# EAGLE design main_schematic_correction (EAGLE 7.1.0)
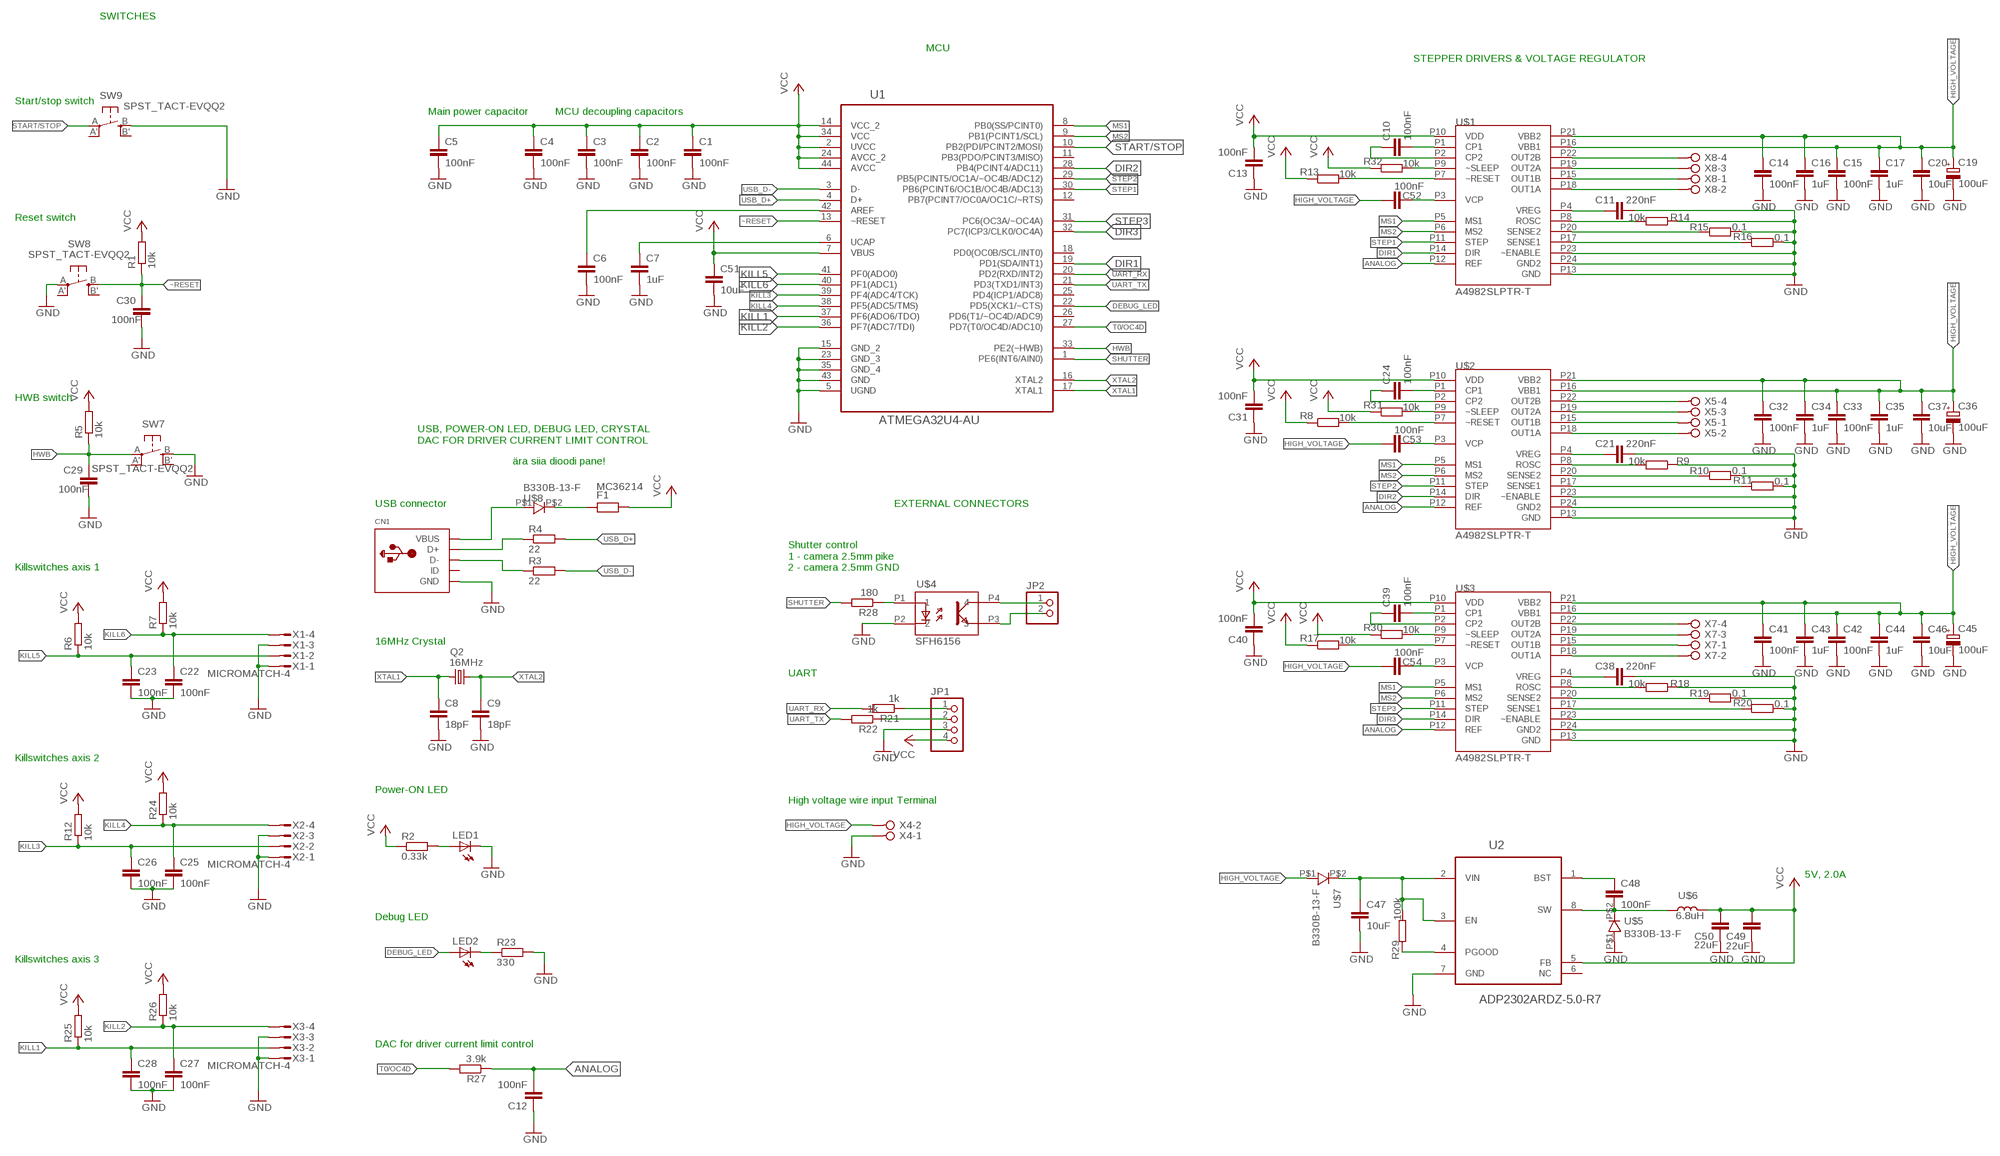
[diagram p0: schematic, sheet 1]

## Parts
C1  100nF  C-EUC0603K  [C0603K]
C2  100nF  C-EUC0603K  [C0603K]
C3  100nF  C-EUC0603K  [C0603K]
C4  100nF  C-EUC0603K  [C0603K]
C5  100nF  C-EUC0603K  [C0603K]
C6  100nF  C-EUC0603K  [C0603K]
C7  1uF  C-EUC0603K  [C0603K]
C8  18pF  C-EUC0603K  [C0603K]
C9  18pF  C-EUC0603K  [C0603K]
C10  100nF  C-EUC0603K  [C0603K]
C11  220nF  C-EUC0603K  [C0603K]
C12  100nF  C-EUC0603K  [C0603K]
C13  100nF  C-EUC0603K  [C0603K]
C14  100nF  C-EUC0603K  [C0603K]
C15  100nF  C-EUC0603K  [C0603K]
C16  1uF  C-EUC0603K  [C0603K]
C17  1uF  C-EUC0603K  [C0603K]
C19  100uF  CPOL-EUE/7260-38R  [E/7260-38R]
C20  10uF  C-EUC1206K  [C1206K]
C21  220nF  C-EUC0603K  [C0603K]
C22  100nF  C-EUC0603K  [C0603K]
C23  100nF  C-EUC0603K  [C0603K]
C24  100nF  C-EUC0603K  [C0603K]
C25  100nF  C-EUC0603K  [C0603K]
C26  100nF  C-EUC0603K  [C0603K]
C27  100nF  C-EUC0603K  [C0603K]
C28  100nF  C-EUC0603K  [C0603K]
C29  100nF  C-EUC0603K  [C0603K]
C30  100nF  C-EUC0603K  [C0603K]
C31  100nF  C-EUC0603K  [C0603K]
C32  100nF  C-EUC0603K  [C0603K]
C33  100nF  C-EUC0603K  [C0603K]
C34  1uF  C-EUC0603K  [C0603K]
C35  1uF  C-EUC0603K  [C0603K]
C36  100uF  CPOL-EUE/7260-38R  [E/7260-38R]
C37  10uF  C-EUC1206K  [C1206K]
C38  220nF  C-EUC0603K  [C0603K]
C39  100nF  C-EUC0603K  [C0603K]
C40  100nF  C-EUC0603K  [C0603K]
C41  100nF  C-EUC0603K  [C0603K]
C42  100nF  C-EUC0603K  [C0603K]
C43  1uF  C-EUC0603K  [C0603K]
C44  1uF  C-EUC0603K  [C0603K]
C45  100uF  CPOL-EUE/7260-38R  [E/7260-38R]
C46  10uF  C-EUC1206K  [C1206K]
C47  10uF  C-EUC1206K  [C1206K]
C48  100nF  C-EUC1206K  [C1206K]
C49  22uF  C-EUC1206K  [C1206K]
C50  22uF  C-EUC1206K  [C1206K]
C51  10uF  C-EUC0805  [C0805]
C52  100nF  C-EUC0603K  [C0603K]
C53  100nF  C-EUC0603K  [C0603K]
C54  100nF  C-EUC0603K  [C0603K]
CN1  USBMINIB  [USB-MINIB]
F1  MC36214  [MC36214]
JP1  PINHD-1X4  [1X04]
JP2  PINHD-1X2  [1X02]
LED1  LEDCHIP-LED0603  [CHIP-LED0603]
LED2  LEDCHIP-LED0603  [CHIP-LED0603]
Q2  16MHz  CRYSTALSM49  [SM49]
R1  10k  R-EU_R0603  [R0603]
R2  0.33k  R-EU_R0603  [R0603]
R3  22  R-EU_R0603  [R0603]
R4  22  R-EU_R0603  [R0603]
R5  10k  R-EU_R0603  [R0603]
R6  10k  R-EU_R0603  [R0603]
R7  10k  R-EU_R0603  [R0603]
R8  10k  R-EU_R0603  [R0603]
R9  10k  R-EU_R0603  [R0603]
R10  0.1  R-EU_R0805  [R0805]
R11  0.1  R-EU_R0805  [R0805]
R12  10k  R-EU_R0603  [R0603]
R13  10k  R-EU_R0603  [R0603]
R14  10k  R-EU_R0603  [R0603]
R15  0.1  R-EU_R0805  [R0805]
R16  0.1  R-EU_R0805  [R0805]
R17  10k  R-EU_R0603  [R0603]
R18  10k  R-EU_R0603  [R0603]
R19  0.1  R-EU_R0805  [R0805]
R20  0.1  R-EU_R0805  [R0805]
R21  1k  R-EU_R0603  [R0603]
R22  1k  R-EU_R0603  [R0603]
R23  330  R-EU_R0603  [R0603]
R24  10k  R-EU_R0603  [R0603]
R25  10k  R-EU_R0603  [R0603]
R26  10k  R-EU_R0603  [R0603]
R27  3.9k  R-EU_R0603  [R0603]
R28  180  R-EU_R0603  [R0603]
R29  100k  R-EU_R0603  [R0603]
R30  10k  R-EU_R0603  [R0603]
R31  10k  R-EU_R0603  [R0603]
R32  10k  R-EU_R0603  [R0603]
SW7  SPST_TACT-EVQQ2  [EVQ-Q2]
SW8  SPST_TACT-EVQQ2  [EVQ-Q2]
SW9  SPST_TACT-EVQQ2  [EVQ-Q2]
U1  ATMEGA32U4-AU  [QFP80P1200X1200X120-44N]
U2  ADP2302ARDZ-5.0-R7  [SOIC127P600X175-9N]
U$1  A4982SLPTR-T  [TSSOP_24]
U$2  A4982SLPTR-T  [TSSOP_24]
U$3  A4982SLPTR-T  [TSSOP_24]
U$4  SFH6156  [SFH6165]
U$5  B330B-13-F  SCHOTTK_YB330B-13-F  [B330B-13-F]
U$6  6.8uH  VLF10040  [VLF10040]
U$7  B330B-13-F  SCHOTTK_YB330B-13-F  [B330B-13-F]
U$8  B330B-13-F  SCHOTTK_YB330B-13-F  [B330B-13-F]
X1  MICROMATCH-4  [MICROMATCH-4]
X2  MICROMATCH-4  [MICROMATCH-4]
X3  MICROMATCH-4  [MICROMATCH-4]
X4  W237-02P  [W237-132]
X5  W237-04P  [W237-4P]
X7  W237-04P  [W237-4P]
X8  W237-04P  [W237-4P]

## Nets
ANALOG: C12.2 R27.1 U$1.P12(REF) U$2.P12(REF) U$3.P12(REF)
DEBUG_LED: LED2.A U1.22(PD5(XCK1/~CTS))
DIR1: U1.19(PD1(SDA/INT1)) U$1.P14(DIR)
DIR2: U1.28(PB4(PCINT4/ADC11)) U$2.P14(DIR)
DIR3: U1.32(PC7(ICP3/CLK0/OC4A)) U$3.P14(DIR)
GND: C1.2 C2.2 C3.2 C4.2 C5.2 C6.2 C7.2 C8.2 C9.2 C11.1 C12.1 C13.1 C14.2 C15.2 C16.2 C17.2 C19.- C20.2 C21.1 C22.2 C23.2 C25.2 C26.2 C27.2 C28.2 C29.2 C30.2 C31.1 C32.2 C33.2 C34.2 C35.2 C36.- C37.2 C38.1 C40.1 C41.2 C42.2 C43.2 C44.2 C45.- C46.2 C47.2 C49.1 C50.1 C51.2 CN1.GND JP1.3 LED1.C R9.1 R10.2 R11.2 R14.1 R15.2 R16.2 R18.1 R19.2 R20.2 R23.2 SW7.B(S) SW8.A(P) SW9.B(S) U1.5(UGND) U1.15(GND_2) U1.23(GND_3) U1.35(GND_4) U1.43(GND) U2.7(GND) U$1.P13(GND) U$1.P23(~ENABLE) U$1.P24(GND2) U$2.P13(GND) U$2.P23(~ENABLE) U$2.P24(GND2) U$3.P13(GND) U$3.P23(~ENABLE) U$3.P24(GND2) U$4.P2 U$5.P$1 X1.1 X1.3 X2.1 X2.3 X3.1 X3.3 X4.1
HIGH_VOLTAEG: C47.1 R29.2 U2.2(VIN) U2.3(EN) U$7.P$2
HIGH_VOLTAGE: C14.1 C15.1 C16.1 C17.1 C19.+ C20.1 C32.1 C33.1 C34.1 C35.1 C36.+ C37.1 C41.1 C42.1 C43.1 C44.1 C45.+ C46.1 U$1.P16(VBB1) U$1.P21(VBB2) U$2.P16(VBB1) U$2.P21(VBB2) U$3.P16(VBB1) U$3.P21(VBB2) U$7.P$1 X4.2
HWB: C29.1 R5.1 SW7.A(P) U1.33(PE2(~HWB))
KILL1: C28.1 R25.1 U1.37(PF6(ADO6/TDO)) X3.2
KILL2: C27.1 R26.1 U1.36(PF7(ADC7/TDI)) X3.4
KILL3: C26.1 R12.1 U1.39(PF4(ADC4/TCK)) X2.2
KILL4: C25.1 R24.1 U1.38(PF5(ADC5/TMS)) X2.4
KILL5: C23.1 R6.1 U1.41(PF0(ADO0)) X1.2
KILL6: C22.1 R7.1 U1.40(PF1(ADC1)) X1.4
MS1: U1.8(PB0(SS/PCINT0)) U$1.P5(MS1) U$2.P5(MS1) U$3.P5(MS1)
MS2: U1.9(PB1(PCINT1/SCL)) U$1.P6(MS2) U$2.P6(MS2) U$3.P6(MS2)
N$1: JP2.1 U$4.P4
N$2: C6.1 U1.42(AREF)
N$3: LED1.A R2.2
N$4: CN1.D- R3.1
N$5: CN1.D+ R4.1
N$6: C10.2 U$1.P1(CP1)
N$7: C10.1 U$1.P2(CP2)
N$8: U$1.P15(OUT1B) X8.1
N$9: U$1.P22(OUT2B) X8.4
N$10: C11.2 U$1.P4(VREG)
N$11: C7.1 U1.6(UCAP)
N$12: R13.2 U$1.P7(~RESET)
N$13: C24.2 U$2.P1(CP1)
N$14: R14.2 U$1.P8(ROSC)
N$15: R15.1 U$1.P20(SENSE2)
N$16: R16.1 U$1.P17(SENSE1)
N$17: C24.1 U$2.P2(CP2)
N$18: U$1.P19(OUT2A) X8.3
N$19: R10.1 U$2.P20(SENSE2)
N$20: U$1.P18(OUT1A) X8.2
N$21: R11.1 U$2.P17(SENSE1)
N$22: U$2.P22(OUT2B) X5.4
N$23: U$2.P15(OUT1B) X5.1
N$24: U$2.P19(OUT2A) X5.3
N$25: U$2.P18(OUT1A) X5.2
N$26: C21.2 U$2.P4(VREG)
N$27: R8.2 U$2.P7(~RESET)
N$28: R9.2 U$2.P8(ROSC)
N$29: C39.2 U$3.P1(CP1)
N$30: C39.1 U$3.P2(CP2)
N$31: R19.1 U$3.P20(SENSE2)
N$32: R20.1 U$3.P17(SENSE1)
N$33: U$3.P22(OUT2B) X7.4
N$34: U$3.P15(OUT1B) X7.1
N$35: U$3.P19(OUT2A) X7.3
N$36: U$3.P18(OUT1A) X7.2
N$37: C38.2 U$3.P4(VREG)
N$38: R17.2 U$3.P7(~RESET)
N$39: CN1.VBUS U$8.P$1
N$40: JP1.1 R21.1
N$41: JP1.2 R22.1
N$42: JP2.2 U$4.P3
N$43: R18.2 U$3.P8(ROSC)
N$44: LED2.C R23.1
N$45: R29.1 U2.4(PGOOD)
N$47: C48.1 U2.1(BST)
N$48: R28.1 U$4.P1
N$49: F1.P$1 U$8.P$2
N$50: C52.1 U$1.P3(VCP)
N$51: C48.2 U2.8(SW) U$5.P$2 U$6.P$2
N$52: C53.1 U$2.P3(VCP)
N$53: C54.1 U$3.P3(VCP)
N$78: R30.2 U$3.P9(~SLEEP)
N$95: R31.2 U$2.P9(~SLEEP)
N$98: R32.2 U$1.P9(~SLEEP)
N$134: C52.2
N$135: C53.2
N$136: C54.2
SHUTTER: R28.2 U1.1(PE6(INT6/AIN0))
START/STOP: SW9.A(P) U1.10(PB2(PDI/PCINT2/MOSI))
STEP1: U1.30(PB6(PCINT6/OC1B/OC4B/ADC13)) U$1.P11(STEP)
STEP2: U1.29(PB5(PCINT5/OC1A/~OC4B/ADC12)) U$2.P11(STEP)
STEP3: U1.31(PC6(OC3A/~OC4A)) U$3.P11(STEP)
T0/OC4D: R27.2 U1.27(PD7(T0/OC4D/ADC10))
UART_RX: R21.2 U1.20(PD2(RXD/INT2))
UART_TX: R22.2 U1.21(PD3(TXD1/INT3))
USB_D+: R4.2 U1.4(D+)
USB_D-: R3.2 U1.3(D-)
VCC: C1.1 C2.1 C3.1 C4.1 C5.1 C13.2 C31.2 C40.2 C49.2 C50.2 C51.1 F1.P$2 JP1.4 R1.2 R2.1 R5.2 R6.2 R7.2 R8.1 R12.2 R13.1 R17.1 R24.2 R25.2 R26.2 R30.1 R31.1 R32.1 U1.2(UVCC) U1.7(VBUS) U1.14(VCC_2) U1.24(AVCC_2) U1.34(VCC) U1.44(AVCC) U2.5(FB) U$1.P10(VDD) U$2.P10(VDD) U$3.P10(VDD) U$6.P$1
XTAL1: C8.1 Q2.1 U1.17(XTAL1)
XTAL2: C9.1 Q2.2 U1.16(XTAL2)
~RESET: C30.1 R1.1 SW8.B(S) U1.13(~RESET)
Unconnected: CN1.ID SW7.A'(P1) SW7.B'(S1) SW8.A'(P1) SW8.B'(S1) SW9.A'(P1) SW9.B'(S1) U1.11(PB3(PDO/PCINT3/MISO)) U1.12(PB7(PCINT7/OC0A/OC1C/~RTS)) U1.18(PD0(OC0B/SCL/INT0)) U1.25(PD4(ICP1/ADC8)) U1.26(PD6(T1/~OC4D/ADC9)) U2.6(NC)

## Notes on the sheet
- SWITCHES
- MCU
- STEPPER DRIVERS & VOLTAGE REGULATOR
- Start/stop switch
- Main power capacitor | MCU decoupling capacitors
- Reset switch
- HWB switch
- USB, POWER-ON LED, DEBUG LED, CRYSTAL
  DAC FOR DRIVER CURRENT LIMIT CONTROL
- ära siia dioodi pane!
- USB connector | EXTERNAL CONNECTORS
- Killswitches axis 1
- Shutter control
  1 - camera 2.5mm pike
  2 - camera 2.5mm GND
- 16MHz Crystal
- UART
- Killswitches axis 2
- Power-ON LED
- High voltage wire input Terminal
- 5V, 2.0A
- Debug LED
- Killswitches axis 3
- DAC for driver current limit control

## Library data of the parts
C1-C17 C20-C35 C37-C44 C46-C54 = rcl:C-EU: CAPACITOR, European symbol
C19 C36 C45 = rcl:CPOL-EU: POLARIZED CAPACITOR, European symbol
CN1 = adafruit:USB: USB Connectors USBMINIB - Surface Mount Female Mini-B USB Connector 4UConnector: 06564 By microbuilder.eu Thru-hole RA Female Mini-B USB Connector 4UConnector: 18732 By ladyada.net
F1 = PTC:MC36214
JP1 = pinhead:PINHD-1X4: PIN HEADER
JP2 = pinhead:PINHD-1X2: PIN HEADER
LED1 LED2 = adafruit:LED: LED OSRAM: - CHIPLED LG R971, LG N971, LY N971, LG Q971, LY Q971, LO R971, LY R971 LH N974, LH R974 LS Q976, LO Q976, LY Q976 LO Q996 - Hyper CHIPLED LW Q18S LB Q993, LB Q99A, LB R99A - SideLED LS A670, LO A670, LY A670, LG A670, LP A670 LB A673, LV A673, LT A673, LW A673 LH A674 LY A675 LS A676, LA A676, LO A676, LY A676, LW A676 LS A679, LY A679, LG A679 - Hyper Micro SIDELED® LS Y876, LA Y876, LO Y876, LY Y876 LT Y87S - SmartLED LW L88C, LW L88S LB L89C, LB L89S, LG L890 LS L89K, LO L89K, LY L89K LS L896, LA L896, LO L896, LY L896 - TOPLED LS T670, LO T670, LY T670, LG T670, LP T670 LSG T670, LSP T670, LSY T670, LOP T670, LYG T670 LG T671, LOG T671, LSG T671 LB T673, LV T673, LT T673, LW T673 LH T674 LS T676, LA T676, LO T676, LY T676, LB T676, LH T676, LSB T676, LW T676 LB T67C, LV T67C, LT T67C, LS T67K, LO T67K, LY T67K, LW E67C LS E67B, LA E67B, LO E67B, LY E67B, LB E67C, LV E67C, LT E67C LW T67C LS T679, LY T679, LG T679 LS T770, LO T770, LY T770, LG T770, LP T770 LB T773, LV T773, LT T773, LW T773 LH T774 LS E675, LA E675, LY E675, LS T675 LS T776, LA T776, LO T776, LY T776, LB T776 LHGB T686 LT T68C, LB T68C - Hyper Mini TOPLED® LB M676 - Mini TOPLED Santana® LG M470 LS M47K, LO M47K, LY M47K Source: http://www.osram.convergy.de/
Q2 = crystal:CRYSTAL: CRYSTAL; OC_FARNELL: unknown; OC_NEWARK: unknown
R1-R32 = rcl:R-EU_: RESISTOR, European symbol
SW7-SW9 = adafruit:SPST_TACT: SMT 6mm switch, EVQQ2 series http://www.ladyada.net/library/eagle
U1 = ATmega32U4:ATMEGA32U4-AU: 8-bit Microcontroller with ISP Flash and USB Controller; MPN: ATMEGA32U4-AU; OC_FARNELL: 1748525; OC_NEWARK: 26R5633; PACKAGE: TQFP-44; SUPPLIER: Atmel
U2 = ADP2302ARDZ-5.0-R7:ADP2302ARDZ-5.0-R7: Step-Down Regulators; MPN: ADP2302ARDZ-5.0-R7; OC_FARNELL: 2312892; OC_NEWARK: 67W2704; PACKAGE: SOIC-8; SUPPLIER: Analog Devices
U$1-U$3 = Allegro_A4982_driver:A4982SLPTR-T
U$4 = SFH6156:SFH6156
U$5 U$7 U$8 = schottky_B330B-13-F:SCHOTTK_YB330B-13-F
U$6 = InductorVLF10040:VLF10040
X1-X3 = con-amp-micromatch:MICROMATCH-4: MicroMaTch 4 7-215464-4 / 0-215464-4 Drawing Number C-215464 DDEController.pdf; MPN: 7-215464-4; OC_FARNELL: 3784629; OC_NEWARK: 19R8124
X4 = con-wago-508:W237-02P: WAGO SREW CLAMP; OC_FARNELL: unknown; OC_NEWARK: unknown
X5 X7 X8 = con-wago-508:W237-04P: WAGO SREW CLAMP; OC_FARNELL: unknown; OC_NEWARK: unknown

## Board
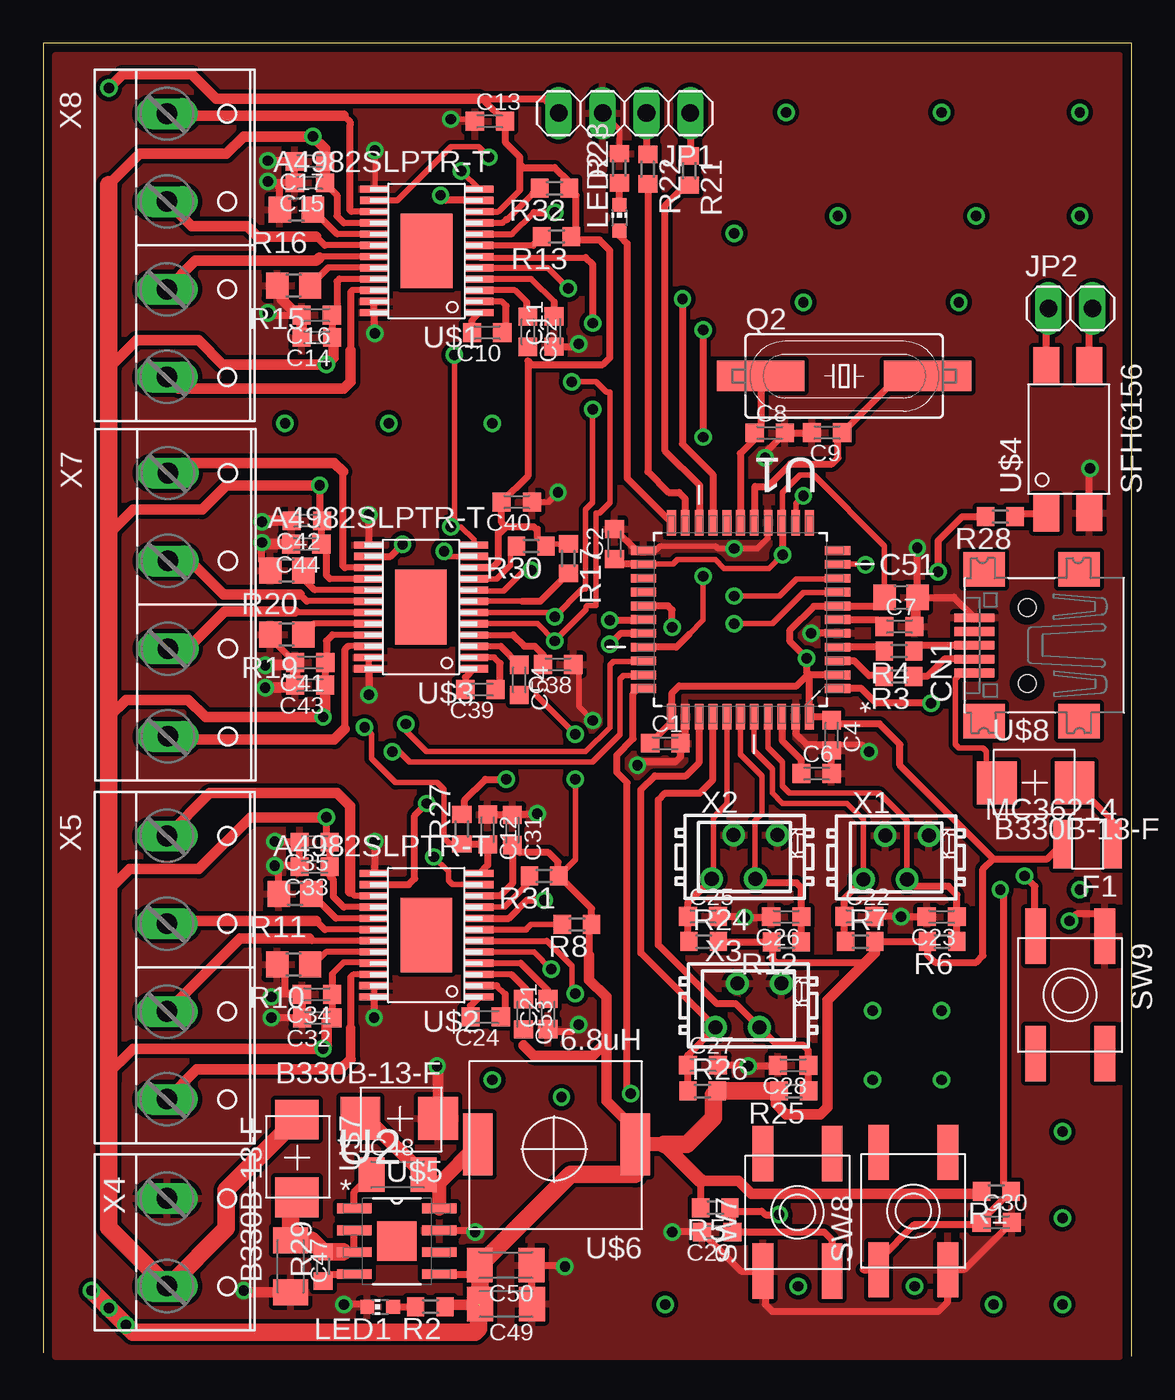
[diagram p1: board, top side]
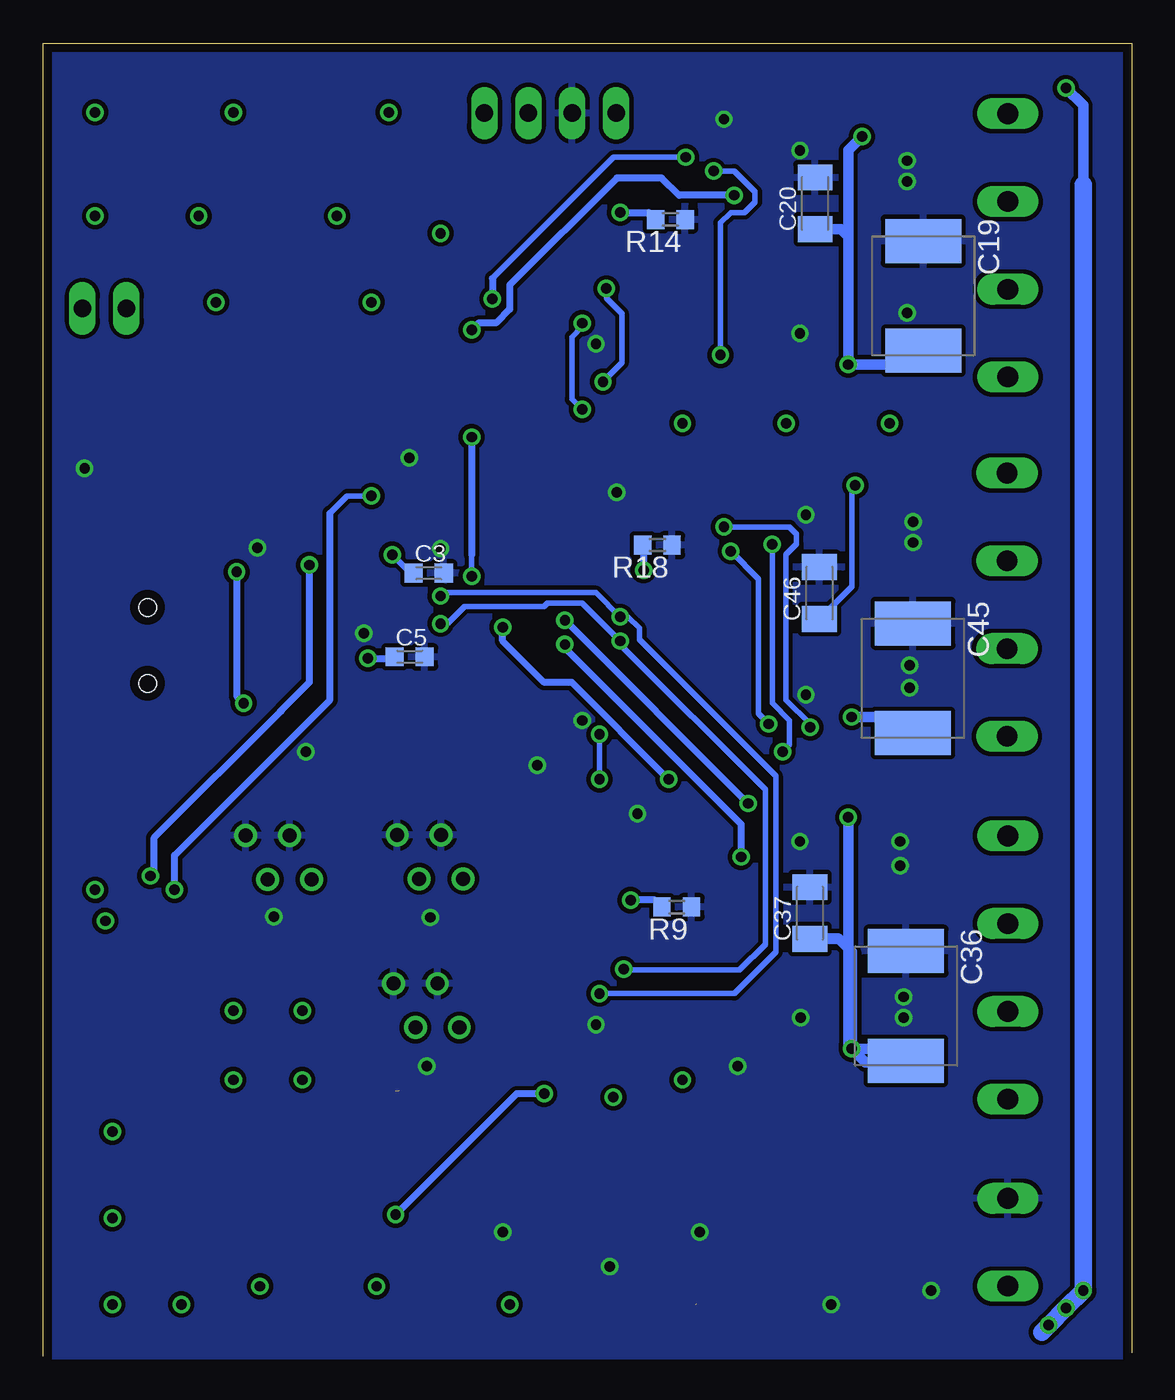
[diagram p2: board, bottom side, seen from below]

Size 63 x 76 mm. Coordinates in mm from the lower left corner, seen from the top.
Outline: 63,0 63,76 0,76 0,0.2
Copper layers (1*16): Top 0.035mm / dielectric 1.5mm / Bottom 0.035mm
Design rules "EDT_DRC": minimum track width 0.3mm, minimum drill 0.5mm, track to track 0.25mm, track to pad 0.25mm, pad to pad 0.25mm, via to via 0.25mm, smd to smd 0mil, copper to edge 0.5mm, drill to drill 8mil, minimum pad ring 10mil, minimum via ring 8mil, stop-mask expansion 4mil, vias tented up to drill 0mil, thermal gap 10mil

### Footprints (pad centres in the part's own frame; a part is rotated, then mirrored left to right if it is on the bottom)
C0603K = smd 1.05 x 1.08: 1 -0.875,0; 2 0.875,0
E/7260-38R = smd 2.55 x 4.4: + 3.175,0; - -3.175,0
C1206K = smd 1.5 x 2: 1 -1.5,0; 2 1.5,0
C0805 = smd 1.3 x 1.5: 1 -0.95,0; 2 0.95,0
USB-MINIB = smd 0.5 x 2.308: D+ 0,4.064; D- -0.8,4.064; GND 1.6,4.064; ID 0.8,4.064; VBUS -1.6,4.064 | smd 2 x 2.4: GND1 -4.4,-2; GND2 -4.4,3.5; GND3 4.4,3.5; GND4 4.4,-2 | hole 1: -2.2,1; 2.2,1
MC36214 = smd 1 x 2.8: P$1 0.239,1.4; P$2 3.196,1.39
1X04 = drill 1.016 long: 1 -3.81,0; 2 -1.27,0; 3 1.27,0; 4 3.81,0
1X02 = drill 1.016 long: 1 -1.27,0; 2 1.27,0
CHIP-LED0603 = smd 0.8 x 0.8: A 0,-0.75; C 0,0.75
SM49 = smd 5.08 x 1.778: 1 -4.826,0; 2 4.826,0
R0603 = smd 1 x 1.1: 1 -0.85,0; 2 0.85,0
R0805 = smd 1.3 x 1.5: 1 -0.95,0; 2 0.95,0
EVQ-Q2 = smd 3.2 x 1.2: A -3.4,-2; A' 3.4,-2; B -3.4,2; B' 3.4,2
QFP80P1200X1200X120-44N = smd 1.473 x 0.508: 1 -5.613,3.988; 2 -5.613,3.2; 3 -5.613,2.388; 4 -5.613,1.6; 5 -5.613,0.787; 6 -5.613,0; 7 -5.613,-0.787; 8 -5.613,-1.6; 9 -5.613,-2.388; 10 -5.613,-3.2; 11 -5.613,-3.988; 23 5.613,-3.988; 24 5.613,-3.2; 25 5.613,-2.388; 26 5.613,-1.6; 27 5.613,-0.787; 28 5.613,0; 29 5.613,0.787; 30 5.613,1.6; 31 5.613,2.388; 32 5.613,3.2; 33 5.613,3.988 | smd 0.508 x 1.473: 12 -3.988,-5.613; 13 -3.2,-5.613; 14 -2.388,-5.613; 15 -1.6,-5.613; 16 -0.787,-5.613; 17 0,-5.613; 18 0.787,-5.613; 19 1.6,-5.613; 20 2.388,-5.613; 21 3.2,-5.613; 22 3.988,-5.613; 34 3.988,5.613; 35 3.2,5.613; 36 2.388,5.613; 37 1.6,5.613; 38 0.787,5.613; 39 0,5.613; 40 -0.787,5.613; 41 -1.6,5.613; 42 -2.388,5.613; 43 -3.2,5.613; 44 -3.988,5.613
SOIC127P600X175-9N = smd 1.981 x 0.559: 1 -2.464,1.905; 2 -2.464,0.635; 3 -2.464,-0.635; 4 -2.464,-1.905; 5 2.464,-1.905; 6 2.464,-0.635; 7 2.464,0.635; 8 2.464,1.905 | smd 2.286 x 2.286: 9 0,0
TSSOP_24 = smd 1.65 x 0.42: P1 -3.175,3.67; P2 -3.175,3.02; P3 -3.175,2.37; P4 -3.175,1.72; P5 -3.175,1.07; P6 -3.175,0.42; P7 -3.175,-0.23; P8 -3.175,-0.88; P9 -3.175,-1.53; P10 -3.175,-2.18; P11 -3.175,-2.83; P12 -3.175,-3.48; P13 2.925,-3.48; P14 2.925,-2.83; P15 2.925,-2.18; P16 2.925,-1.53; P17 2.925,-0.88; P18 2.925,-0.23; P19 2.925,0.42; P20 2.925,1.07; P21 2.925,1.72; P22 2.925,2.37; P23 2.925,3.02; P24 2.925,3.67 | smd 3 x 4.32: P$1 -0.102,0.099
SFH6165 = smd 2.1 x 1.5: P1 -1.13,3.656; P2 -1.12,1.156; P3 7.446,1.156; P4 7.442,3.656
B330B-13-F = smd 2.3 x 2.5: P$1 -2.2,-0.022; P$2 2.299,-0.022
VLF10040 = smd 1.7 x 3.6: P$1 0.4,4.8; P$2 9.51,4.8
MICROMATCH-4 = drill 0.813: 1 1.905,1.27; 2 0.635,-1.27; 3 -0.635,1.27; 4 -1.905,-1.27
W237-132 = drill 1.194 long: 1 -2.54,-0.635; 2 2.54,-0.635
W237-4P = drill 1.194 long: 1 -7.62,-0.635; 2 -2.54,-0.635; 3 2.54,-0.635; 4 7.62,-0.635

### Placement (x,y rotation side)
C1  36.01,35.48 0 top
C2  33.07,47.01 90 top
C3  40.69,45.33 0 bottom
C4  45.63,35.94 270 top
C5  41.79,40.48 0 bottom
C6  44.76,33.73 0 top
C7  49.56,42.24 0 top
C8  42.06,53.44 0 top
C9  45.37,53.46 180 top
C10  25.7,59.25 180 top
C11  29.57,59.31 90 top
C12  25.73,30.49 270 top
C13  25.86,71.48 0 top
C14  15.84,58.97 180 top
C15  15.44,67.92 180 top
C16  15.83,60.26 180 top
C17  15.44,69.16 180 top
C19  12.06,61.37 270 bottom
C20  18.32,66.73 90 bottom
C21  29.22,19.81 90 top
C22  47.24,25.46 0 top
C23  52.01,25.44 180 top
C24  25.61,19.64 180 top
C25  38.19,25.46 0 top
C26  43.01,25.44 180 top
C27  38.19,16.86 0 top
C28  43.41,16.84 180 top
C29  39.01,7.19 180 top
C30  55.19,7.76 0 top
C31  27.16,30.46 270 top
C32  15.86,19.59 180 top
C33  15.71,28.34 180 top
C34  15.85,20.95 180 top
C35  15.71,29.76 180 top
C36  13.06,20.28 270 bottom
C37  18.62,25.65 90 bottom
C38  29.81,40.04 180 top
C39  25.31,38.59 180 top
C40  27.41,49.44 180 top
C41  15.46,40.16 180 top
C42  15.26,48.36 180 top
C43  15.45,38.85 180 top
C44  15.23,47.01 180 top
C45  12.66,39.24 270 bottom
C46  18.07,44.17 90 bottom
C47  14.32,5.21 270 top
C48  20.51,10.52 0 top
C49  26.79,3.03 180 top
C50  26.77,5.28 180 top
C51  49.65,43.93 0 top
C52  28.05,59.3 270 top
C53  27.8,19.8 270 top
C54  27.55,39.15 270 top
CN1  57.96,41.15 90 top
F1  62.17,31.03 180 top
JP1  33.65,71.95 180 top
JP2  59.46,60.65 0 top
LED1  19.51,2.86 90 top
LED2  33.35,65.89 0 top
Q2  46.36,56.74 0 top
R1  55.17,9.55 180 top
R2  22.41,2.88 180 top
R3  49.53,39.35 180 top
R4  49.54,40.82 180 top
R5  38.9,8.6 180 top
R6  52.03,24 180 top
R7  47.29,24 0 top
R8  30.89,25 180 top
R9  26.33,26 180 bottom
R10  14.5,22.68 180 top
R11  14.58,26.77 180 top
R12  43.02,23.98 180 top
R13  29.71,64.8 180 top
R14  26.69,65.8 180 bottom
R15  14.5,61.97 180 top
R16  14.65,66.37 180 top
R17  30.4,46.17 270 top
R18  27.45,46.95 180 bottom
R19  14.1,41.77 180 top
R20  14.1,45.47 180 top
R21  37.4,68.63 270 top
R22  35,68.71 270 top
R23  33.35,68.76 90 top
R24  38.23,24 0 top
R25  43.45,15.35 180 top
R26  38.17,15.35 0 top
R27  24.23,30.51 90 top
R28  55.4,48.6 180 top
R29  16.2,5.2 90 top
R30  28.25,46.9 180 top
R31  29,27.8 180 top
R32  29.6,67.6 180 top
SW7  43.66,8.33 90 top
SW8  50.36,8.41 90 top
SW9  59.44,20.91 270 top
U1  40.36,42.64 180 top
U2  20.47,6.66 0 top
U$1  22.08,64.07 180 top
U$2  22.07,24.47 180 top
U$3  21.76,43.47 180 top
U$4  61.71,49.92 90 top
U$5  20.66,13.75 180 top
U$6  34.66,17.07 180 top
U$7  14.7,11.5 270 top
U$8  57.4,33.2 0 top
X1  49.37,28.87 0 top
X2  40.6,28.9 0 top
X3  40.82,20.3 0 top
X4  7.8,6.6 270 top
X5  7.8,22.5 270 top
X7  7.85,43.5 270 top
X8  7.8,64.3 270 top

### Tracks (layer width: path | path; a pad name or v marks a point on that pad's centre or on a via)
ANALOG  (via drill 0.6)
  Top 0.305: R27.1 23.54,29.66 23.2,30 23.2,32.8 22.8,33.2 20.4,33.2 19,34.6 19,36 v18.6,36.4 | U$3.P12 24.93,47.27 24.2,48 v23.6,48 23.8,48.2 v23.8,57.95 | U$1.P12 v24.2,68.6
  Top 0.406: 25.28,27.98 U$2.P12 25.73,28.43 C12.2 25.68,29.66 R27.1
  Bottom 0.305: v18.6,36.4 18.6,36.6 20,38 20,46.4 19.4,47 19.4,47.6 19.8,48 v23.6,48 | v24.2,68.6 23,68.6 21.8,67.4 21.8,66.8 22.4,66.2 23.2,66.2 23.8,65.6 v23.8,57.95
DEBUG_LED
  Top 0.406: LED2.A 33.35,64.85 33.8,64.4 33.8,50.83 U1.22
DIR1  (via drill 0.6)
  Top 0.305: 20.5,66.9 23.6,70 25.2,70 v25.8,69.4
  Top 0.35: U$1.P14 20.5,66.9
  Top 0.406: v37,61.2 37,52.8 38.76,51.04 U1.19
  Bottom 0.305: v25.8,69.4 30,69.4 37,62.4
  Bottom 0.406: 37,62.4 v37,61.2
DIR2  (via drill 0.6)
  Top 0.406: U$2.P14 21.15,27.3 21.5,27.65 21.5,31.3 v22.2,32 22.25,32.05 | v32.8,42.6 34.71,42.6 U1.28
  Bottom 0.406: v22.2,32 v32.8,42.6
DIR3  (via drill 0.6)
  Top 0.305: U1.32 34.71,39.4 33.6,39.4 33.4,39.2 33.4,36 31.8,34.4 21.2,34.4 20.6,35 v20.2,35
  Top 0.406: U$3.P14 20.1,46.3 v20.8,47
  Bottom 0.305: v20.8,47 20.8,37.8 19.8,36.8 19.8,35.4 v20.2,35
GND  (via drill 0.6)
  Top 0.305: R23.2 33.35,70.98 JP1.3 | U1.43 43.6,36.99 43.6,36 | 44.2,35.4 47.4,35.4 v47.8,35 | U$1.P13 19.2,67.59 v19.2,69.8 | C13.1 24.86,71.6 v23.6,71.6 | 18.7,3 18.7,2.92 LED1.C | 31,40.35 31,37.6 v31.8,36.8 | C40.1 29.24,49.44 v29.8,50 | U1.15 41.96,47.36 41.35,46.75 v40,46.75 39.05,46.75 38.9,46.9 35.7,46.9 35.43,46.63 U1.23 35.17,46.63 35.2,46.6
  Top 0.35: U$3.P23 U$3.P24 | U$2.P23 U$2.P24 | 14,22.03 13.55,22.48 R10.2
  Top 0.406: 13.15,41.65 R19.2 13.15,41.6 | U$3.P13 18.85,46.97 v18.85,48.7 | U$3.P24 18.85,39.78 v18.85,38.3 | v12.65,47.1 12.65,46.01 13.15,45.51 R20.2 | U1.23 34.33,46.63 C2.2 | U1.35 37.16,35.76 C1.2 36.88,34.69 36.6,34.4 34.6,34.4 v34.4,34.2 | U1.5 v44.45,41.85 | SW9.B 61.44,25.56 61.4,25.6 59.8,25.6 59.4,25.2 | 18.7,3 v17.4,3 | C23.2 49.71,25.44 49.7,25.45 v49.65,25.45 C22.2 | C25.2 40.54,25.46 v40.6,25.4 42.09,25.4 C26.2 | U1.43 43.56,36.04 43.6,36 44.2,35.4 45.3,35.4 C4.2 C6.2 | C21.1 29.36,18.8 30.6,18.8 v31,19.2 | C31.1 27.23,31.4 v28.6,31.4 | U$2.P13 19.2,28 v19.2,29.8 | U$2.P24 v19.15,19.6 | C32.2 C34.2 13.35,20.95 | C35.2 C33.2 C35.2 14.8,29.8 | v13.4,29.8 14.8,29.8 | 14.8,29.8 14.8,28.4 v13.4,28.4 13.63,28.17 R11.2 | 13.35,20.95 v13.2,20.8 | 13.35,20.95 13.4,21 14,21 | v13.2,19.6 15,19.6 15,21 14,21 | 14,21 14,22.03 | U$4.P2 60.55,51.35 v60.6,51.4 | U2.7 24.91,7.29 v25,7.2 | U$1.P23 U$1.P24 19.16,59.24 v19.2,59.2 | C15.2 C17.2 | C15.2 C17.2 14.6,69.2 v13,69.2 | C15.2 13.4,67.92 | 13.4,67.92 13.08,67.92 v13,68 | R16.2 13.7,67.62 13.4,67.92 | C27.2 40.74,16.86 v40.8,16.8 42.49,16.8 C28.2 | C11.1 30.84,58.44 v31,58.6 | C49.1 28.27,3.05 C50.1 30.12,5.28 v30.2,5.2 | CN1.GND 52.72,43.93 C51.2 50.44,43.77 C7.2 | C9.2 44.48,53.44 C8.2 41.8,52.3 v41.8,52 | C7.2 50.48,42.2 | C7.2 50.6,42.41 v50.6,46.8 | 52.01,5.01 SW8.A | C30.2 53.31,5.01 SW8.A | SW8.A 52.36,3.16 51.8,2.6 42.2,2.6 41.8,3 41.8,4.79 SW7.B 40.4,4.93 C29.2 v36.4,7.2 | C31.1 27.01,31.34 | C12.1 27.13,31.36 C31.1 | 13.15,41.59 C41.2 | C38.1 31,40.35 | v13,60.4 13.14,60.26 C16.2
  Top 0.61: C44.2 12.74,47.01 v12.65,47.1 | C42.2 12.71,48.36 v12.65,48.3 | v12.85,38.7 14.65,38.7 14.65,38.77 C43.2 14.59,38.86 C41.2 | 14.55,40 v12.85,40 | C14.2 C16.2 | C16.2 14.89,60.2 | R15.2 13.8,61.72 13.8,61.2 14.74,60.26 C16.2 | C47.2 11.69,3.71 v11.6,3.8 | U$5.P$1 22.86,16.74 v22.8,16.8 | R19.2 13.15,41.59
  pour Bottom: 0,0 63,0 63,76 0.6,75.9
  pour Top: 0.7,75.3 0.7,0 62.3,0 62.3,75.3
HIGH_VOLTAEG
  Top 0.406: 17.35,6.05 17.4,6 17.98,6 U2.3 U2.2 | 15.54,6.71 C47.1 | U$7.P$2 14.32,8.84
  Top 1: 17.35,6.05 R29.2 15.54,6.71 | 14.32,8.84 C47.1
HIGH_VOLTAGE  (via drill 0.6)
  Top 0.35: U$3.P21 16.75,41.75 | U$3.P16 16.6,45 | U$2.P16 17.4,26 | 16.73,22.12 17.4,22.8 19.09,22.8 U$2.P21 | 17.4,65.6 U$1.P16 | U$1.P21 17.15,62.35
  Top 0.406: C14.1 16.71,60.25 C16.1 17,60.55 17,62.2 17.15,62.35 | 16.75,41.75 16.4,41.4 16.4,40.27 16.32,40.2 16.32,40.17 | 16.6,45 16.4,45.2 16.4,46.72 C44.1 16.11,48.33 C42.1 16,48.49 v16,50.4 | 17.4,26 16.8,26.6 16.8,27.6 16.59,27.82 C33.1 C35.1 16.4,29.95 v16.4,31.2 | 16.73,22.12 C34.1 C32.1 16.6,19.45 | 17.4,65.6 17,66 17,67.2 16.32,67.89 C15.1 | 7.26,4.06 X4.2 | 16.32,40.17 C43.1 | C41.1 16.32,40.17
  Top 0.61: 3.8,67.8 5.6,69.6 10.6,69.6 11.6,70.6 15.4,70.6 15.6,70.4 v15.6,70.6 16.32,69.89 C17.1 C15.1 | C14.1 16.71,58.63 16.8,58.55 16.8,57.8 v16.4,57.4 10.4,57.4 9,58.8 5.4,58.8 3.8,57.2 | v16,50.4 10.6,50.4 9.2,49 5.2,49 3.8,47.6 | 3.8,37 4.8,38 8.4,38 9.4,37 v16.2,37 16.32,37.12 C43.1 16.34,38.86 | v16.4,31.2 12,31.2 9,28.2 5,28.2 3.8,27 | 3.8,16 3.6,16.2 5.2,17.8 v16.2,17.8 16.4,18 16.4,19.4 16.45,19.45 16.6,19.45
  Top 1: X4.2 3.8,7.42 3.8,16 3.8,27 3.8,37 3.8,47.6 3.8,57.2 3.8,67.8 | U$7.P$1 10.6,9.62 10.6,7.4 7.26,4.06
  Bottom 0.305: 16.2,50.2 16.2,44.54 C46.1
  Bottom 0.406: 16.2,50.2 v16,50.4
  Bottom 0.61: C19.+ 12.86,57.4 v16.4,57.4 16.4,64.8 | 16.4,64.8 16.4,69.8 v15.6,70.6 | C20.1 16.83,65.23 16.4,64.8 | v16.2,37 13.6,37 C45.+ | v16.2,17.8 13.76,17.8 C36.+ | 16.2,31.2 v16.4,31.2 16.4,18 v16.2,17.8 | v16.2,17.8 16.2,23.4 16.95,24.15 | 18.6,24 18.6,24.2 17,24.2 16.95,24.15 | 13,17 15.4,17 v16.2,17.8 | C37.1 16.95,24.15
HWB  (via drill 0.6)
  Top 0.406: SW7.A 45.66,6.74 45.2,7.2 39.9,7.2 C29.1 39.88,8.46 R5.1 39.95,8.4 41.6,8.4 41.8,8.2 v42.6,8.2 | v34,15.2 33.8,15.4 33.8,33.2 33.2,33.8 33.2,34.8 34.15,35.75 34.15,38.35 34.45,38.65 U1.33
  Bottom 0.406: v34,15.2 35.6,15.2 v42.6,8.2
KILL1
  Top 0.406: R25.1 44.3,16.82 C28.1 44.28,17.71 44,18 42.48,18 X3.2 40.09,20.4 39,20.4 35.6,23.8 35.6,32.2 36,32.6 38,32.6 38.76,33.36 U1.37
KILL2
  Top 0.406: R26.1 C27.1 37.31,17.43 X3.4 34.6,23.34 34.6,32.8 35.4,33.6 37.2,33.6 37.97,34.37 U1.36
KILL3
  Top 0.305: X2.2 41.2,27.66 41.2,31 41.6,31.4 41.6,33.6 40.36,34.84 U1.39
  Top 0.406: X2.2 41.47,27.4 43.6,27.4 43.88,27.11 C26.1 43.87,25.43 R12.1
KILL4
  Top 0.305: X2.4 38.8,27.73 38.8,31.2 39.57,31.97 U1.38
  Top 0.406: X2.4 37.31,26.25 C25.1 37.31,24.07 R24.1
KILL5
  Top 0.305: 42,37 41.97,37.03 U1.41 41.96,35.24 42.8,34.4 42.8,33 43.2,32.6 48.41,32.6 50.01,31 X1.2
  Top 0.406: X1.2 50.41,27.2 52.4,27.2 52.88,26.71 C23.1 R6.1
KILL6
  Top 0.305: X1.4 47.47,31.07 46.53,32 42.8,32 42.2,32.6 42.2,34 41.15,35.05 U1.40
  Top 0.406: X1.4 46.37,26.5 C22.1 46.37,24.07 R7.1
MS1  (via drill 0.6)
  Top 0.305: U$2.P5 28.4,23.4 v29.4,22.4 | v40,42.4 42.2,42.4 44,44.2 45.93,44.2 U1.8 | v30.6,56.4 32,56.4 32.6,55.8 32.8,55.8 32.8,49.4 32.2,48.8 32,48.8 32,43.45 31.5,43.45 31.43,43.38 31.43,43.23 v29.6,41.4 28.6,42.4 U$3.P5
  Top 0.35: U$1.P5 29.2,63 v30.4,61.8
  Bottom 0.305: v29.6,41.4 29.6,41.55 | v29.6,41.4 31.8,43.6 33.8,43.6 34,43.4 38.6,43.4 39.6,42.4 v40,42.4 | v29.4,22.4 29.35,22.35 22.7,22.35 21.2,23.85 21.2,32.8 29.6,41.2 v29.6,41.4 | v30.4,61.8 30.4,61.25 29.5,60.35 29.5,57.5 v30.6,56.4
MS2  (via drill 0.6)
  Top 0.305: 29.15,24.05 30.6,22.6 30.6,21.2 v30.8,21 | v40,44 42.6,44 43.6,45 45.95,45 U1.9 | v31.8,54.8 31.8,49.4 31.4,49 31.4,44.4 31.2,44.4 v29.6,42.8 29.35,43.05 U$3.P6
  Top 0.35: U$2.P6 29.15,24.05 | 25.3,63.6 31.4,63.6
  Top 0.406: U$1.P6 25.3,63.6 | 31.4,63.6 31.8,63.2 v31.8,59.8
  Bottom 0.305: v40,44 39.8,44.2 31,44.2 v29.6,42.8 29.15,42.8 28.5,42.15 28.5,41.5 22.4,35.4 22,35 20.6,33.6 20.6,23.4 23,21 v30.8,21 | v31.8,59.8 31.8,59.6 32.4,59 32.4,55.4 v31.8,54.8
N$1
  Top 0.406: U$4.P4 58.05,60.51 JP2.1
N$2
  Top 0.406: C6.1 43.88,34.52 42.8,35.6 42.8,36.97 U1.42
N$3
  Top 0.406: LED1.A 21.54,2.86 R2.2
N$4
  Top 0.406: CN1.D- 52.15,40.35 51.15,39.35 R3.1
N$5
  Top 0.406: CN1.D+ 50.72,41.15 R4.1
N$6
  Top 0.35: 24.82,59.97 U$1.P1
  Top 0.406: C10.2 24.82,59.97
N$7
  Top 0.35: 26.8,60.8 26.55,61.05 U$1.P2
  Top 0.406: C10.1 26.65,59.25 26.8,59.4 26.8,60.8
N$8
  Top 0.35: U$1.P15 17.85,66.25
  Top 0.406: 17.85,66.25 17.75,66.35 17.75,71.2 17.75,71.25 17.75,71.45 17.4,71.8
  Top 0.61: 17.4,71.8 7.29,71.8 X8.1
N$9
  Top 0.35: U$1.P22 17.9,61.7
  Top 0.406: 17.9,61.7 17.8,61.6 17.8,58.2
  Top 0.61: 17.8,58.2 17.8,56.4 17.4,56 7.84,56 X8.4
N$10
  Top 0.35: U$1.P4 28.25,62.35 29.57,61.03
  Top 0.406: 29.57,61.03 C11.2
N$11
  Top 0.406: U1.6 48.28,42.64 C7.1
N$12
  Top 0.35: U$1.P7 28.36,64.3
  Top 0.406: 28.36,64.3 R13.2
N$13
  Top 0.406: U$2.P1 24.73,20.29 C24.2
N$14  (via drill 0.6)
  Top 0.35: U$1.P8 27.15,64.95 28.4,66.2
  Top 0.406: 28.4,66.2 v29.6,66.2
  Bottom 0.406: v29.6,66.2 27.94,66.2 R14.2
N$15
  Top 0.35: U$1.P20 16.48,63
  Top 0.406: 16.48,63 R15.1
N$16
  Top 0.35: U$1.P17 17.02,64.95
  Top 0.406: 17.02,64.95 R16.1
N$17
  Top 0.35: 26.75,20.95 26.25,21.45
  Top 0.406: C24.1 26.75,19.91 26.75,20.95 | 26.25,21.45 U$2.P2
N$18
  Top 0.35: U$1.P19 16.05,63.65
  Top 0.406: 16.05,63.65 16,63.6
  Top 0.61: 16,63.6 15.8,63.4 8.8,63.4 X8.3
N$19
  Top 0.35: U$2.P20 16.37,23.4 15.65,22.68 R10.1
N$20
  Top 0.35: U$1.P18 16.3,64.3
  Top 0.406: 16.3,64.3 15.8,64.8
  Top 0.61: 15.8,64.8 12.4,64.8 11.8,65.4 8.61,65.4 X8.2
N$21
  Top 0.35: U$2.P17 16.95,25.35
  Top 0.406: 16.95,25.35 R11.1
N$22
  Top 0.35: U$2.P22 17.95,22.1 17.8,21.95
  Top 0.406: 17.8,21.95 17.8,19
  Top 0.55: 17.8,19 17.8,17.2
  Top 0.61: 17.8,17.2 17.2,16.6 8.88,16.6 X5.4
N$23
  Top 0.35: U$2.P15 18,26.65 17.75,26.9
  Top 0.61: 17.75,26.9 17.75,31.85 17,32.6 9.64,32.6 X5.1
N$24
  Top 0.35: U$2.P19 15.55,24.05
  Top 0.406: 15.55,24.05 15.4,24.2
  Top 0.61: 15.4,24.2 11.4,24.2 X5.3
N$25
  Top 0.35: U$2.P18 16.3,24.7
  Top 0.406: 16.3,24.7 15.8,25.2
  Top 0.61: 15.8,25.2 7.33,25.2 X5.2
N$26
  Top 0.35: 27.65,22.75 U$2.P4
  Top 0.406: C21.2 29.2,20.7 29.2,21.2 27.65,22.75
N$27
  Top 0.305: 27.95,24.7 28.25,25 R8.2 | 25.34,24.7 U$2.P7
  Top 0.35: 25.34,24.7 27.95,24.7
N$28  (via drill 0.6)
  Top 0.406: U$2.P8 26.95,25.35 28,26.4 v29,26.4
  Bottom 0.305: R9.2 27.58,26.4
  Bottom 0.406: 27.58,26.4 v29,26.4
N$29
  Top 0.406: U$3.P1 24.43,39.3 C39.2
N$30
  Top 0.35: 26.45,40.1 26.1,40.45 U$3.P2
  Top 0.406: C39.1 26.45,38.85 26.45,40.1
N$31
  Top 0.35: U$3.P20 15.68,42.4
  Top 0.406: 15.68,42.4 R19.1
N$32
  Top 0.35: U$3.P17 15.72,44.35
  Top 0.406: 15.72,44.35 15.05,45.02 R20.1
N$33
  Top 0.35: U$3.P22 17.65,41.1
  Top 0.406: 17.65,41.1 17.45,40.9 17.45,36.3
  Top 0.61: 17.45,36.3 16.85,35.7 7.39,35.7 X7.4
N$34
  Top 0.35: U$3.P15 17.45,45.65
  Top 0.406: 17.45,45.65 17.35,45.75 17.35,51.2 | 7.24,51.1 X7.1
  Top 0.61: 17.35,51.2 16.85,51.7 7.79,51.7 X7.1
N$35
  Top 0.35: U$3.P19 14.6,43.05
  Top 0.406: 14.6,43.05 14.55,43.1
  Top 0.61: 14.55,43.1 10.5,43.1 8.36,40.96 X7.3
N$36
  Top 0.35: U$3.P18 15.25,43.7
  Top 0.406: 15.25,43.7 14.85,44.1
  Top 0.61: 14.85,44.1 10.45,44.1 8.51,46.04 X7.2
N$37
  Top 0.35: U$3.P4 27.2,41.75
  Top 0.406: 27.2,41.75 27.85,41.1 28.45,41.1 28.93,40.62 C38.2
N$38
  Top 0.305: U$3.P7 27.72,43.7
  Top 0.406: 27.72,43.7 28.78,43.7 R17.2
N$39
  Top 0.305: CN1.VBUS 53.15,39.55 52.8,39.2 52.8,35.4 53,35.2 54.4,35.2 54.6,35 54.6,33.78 U$8.P$1
N$40
  Top 0.406: JP1.1 37.46,69.54 R21.1
N$41
  Top 0.406: JP1.2 34.92,69.64 R22.1
N$42
  Top 0.406: U$4.P3 60.55,60.15 60.6,60.2 60.6,60.52 JP2.2
N$43  (via drill 0.6)
  Top 0.305: U$3.P8 24.98,44.3 26.65,44.3 27.85,45.5 v28.25,45.5
  Bottom 0.406: R18.2 28.25,46.9 v28.25,45.5
N$44
  Top 0.406: LED2.C R23.1
N$45
  Top 0.406: R29.1 16.61,4.75 U2.4
N$47
  Top 0.406: U2.1 18.01,9.52 C48.1
N$48
  Top 0.406: R28.1 56.44,48.79 U$4.P1
N$49
  Top 0.305: U$8.P$2 61.93,30.95 F1.P$1
N$50
  Top 0.35: 28,61 27.3,61.7 U$1.P3
  Top 0.406: C52.1 28,60.23 28,61
N$51
  Top 0.406: U$5.P$2 18.76,13.77
  Top 0.813: U2.8 22.93,9.6 | 22.93,9.6 C48.2 18.76,13.77 | 22.93,9.6 22.93,10.05 U$6.P$2
N$52
  Top 0.35: 27.1,22.1 U$2.P3
  Top 0.406: C53.1 28,20.88 28,21.2 27.1,22.1
N$53
  Top 0.35: U$3.P3 26.48,41.1
  Top 0.406: 26.48,41.1 C54.1
N$78
  Top 0.305: U$3.P9 26.25,45 27.05,45.8 27.05,46.55 R30.2
N$95
  Top 0.305: U$2.P9 26.7,26 28.15,27.45 R31.2
N$98
  Top 0.35: U$1.P9 26.6,65.6 26.8,65.8 | 26.85,65.8 28.35,67.3
  Top 0.406: 26.8,65.8 26.85,65.8 | 28.35,67.3 28.45,67.3 R32.2
N$100  (via drill 0.6)
  other vias: 60,27
N$101  (via drill 0.6)
  other vias: 59.4,25.2
N$107  (via drill 0.6)
  other vias: 59,13
N$108  (via drill 0.6)
  other vias: 59,8
N$109  (via drill 0.6)
  other vias: 59,3
N$110  (via drill 0.6)
  other vias: 55,3
N$111  (via drill 0.6)
  other vias: 50.45,4.05
N$112  (via drill 0.6)
  other vias: 43.7,4.05
N$113  (via drill 0.6)
  other vias: 36,3
N$116  (via drill 0.6)
  other vias: 52,20
N$117  (via drill 0.6)
  other vias: 48,20
N$118  (via drill 0.6)
  other vias: 48,16
N$119  (via drill 0.6)
  other vias: 52,16
N$120  (via drill 0.6)
  other vias: 26,16
N$121  (via drill 0.6)
  other vias: 30,15
N$122  (via drill 0.6)
  other vias: 14,54
N$123  (via drill 0.6)
  other vias: 20,54
N$124  (via drill 0.6)
  other vias: 26,54
N$125  (via drill 0.6)
  other vias: 43,72
N$126  (via drill 0.6)
  other vias: 60,72
N$127  (via drill 0.6)
  other vias: 52,72
N$128  (via drill 0.6)
  other vias: 40,65
N$129  (via drill 0.6)
  other vias: 44,61
N$130  (via drill 0.6)
  other vias: 53,61
N$131  (via drill 0.6)
  other vias: 46,66
N$132  (via drill 0.6)
  other vias: 54,66
N$133  (via drill 0.6)
  other vias: 60,66
SHUTTER  (via drill 0.6)
  Top 0.406: v51.4,37.8 48.2,37.8 47.35,38.65 U1.1 | v51.8,45.4 51.8,47.2 53.2,48.6 R28.2
  Bottom 0.406: v51.8,45.4 51.8,38.2 v51.4,37.8
START/STOP  (via drill 0.6)
  Top 0.305: U1.10 47.56,45.84 v47.6,45.8
  Top 0.406: SW9.A 57.4,24.35 57.4,27.2 v56.8,27.8
  Bottom 0.406: v56.8,27.8 56.6,28 56.6,30 49.3,37.3 49.2,37.4 47.6,39 v47.6,45.8
STEP1  (via drill 0.6)
  Top 0.305: v38.2,45.15 38.2,42.6 37.4,41.8
  Top 0.406: U$1.P11 23.3,66.9 v23,67.2 | 37.4,41.8 36.65,41.05 U1.30 | v38.2,59.4 v38.2,53.2
  Bottom 0.305: 38.2,46.4 v38.2,45.15
  Bottom 0.406: v23,67.2 26.2,67.2 27.2,68.2 29.8,68.2 36,62 36,60.6 36.8,59.8 37.8,59.8 v38.2,59.4 | v38.2,53.2 38.2,46.4
STEP2  (via drill 0.6)
  Top 0.305: U$2.P11 23.7,27.3 23.45,27.55 23.45,28.05 v22.6,28.9
  Top 0.406: v32.8,41.2 33.45,41.85 U1.29
  Bottom 0.406: v32.8,41.2 32.8,41 22.6,30.8 v22.6,28.9
STEP3  (via drill 0.6)
  Top 0.305: U$3.P11 23.5,46.3 v23.2,46.6 | v21,36.6 21,36.2 22.2,35 31.4,35 32.8,36.4 32.8,40 33,40.2 34.69,40.2 U1.31
  Bottom 0.305: v21,36.6 21.6,37.2 21.6,45 v23.2,46.6
T0/OC4D  (via drill 0.6)
  Top 0.406: R27.2 24.4,31.53 24.4,32.2 25.6,33.4 v26.8,33.4 | v36.4,42.2 36.4,43.2 36.17,43.43 U1.27
  Bottom 0.406: v26.8,33.4 32.4,39 34,39 36.4,41.4 v36.4,42.2
UART_RX
  Top 0.406: U1.20 38,48.28 38,50.4 36,52.4 36,66.6 37.18,67.78 R21.2
UART_TX
  Top 0.406: R22.2 35,51.2 36.2,50 36.8,50 37.16,49.64 U1.21
USB_D+
  Top 0.406: R4.2 48.47,41.04 U1.4
USB_D-
  Top 0.406: R3.2 48.63,39.4 47.8,39.4 46.95,40.25 U1.3
VCC  (via drill 0.6)  (2 unrouted)
  Top 0.305: 28.65,47.9 28.65,47.35 R30.1 29.22,47.02 R17.1 | 34.69,12.7 U$6.P$1 | 32.6,20.2 32.6,19.6 | C51.1 48.7,46.9 44.6,51 43.8,51 42.8,50 v42.8,46.4 42,45.6 39.4,45.6 38.9,46.1 36.7,46.1 36.44,45.84 U1.24 | 28.52,38.27 v30.8,36 | v30.8,33.4 30.8,28.75 R31.1
  Top 0.35: U$1.P10 26.35,66.25 27.6,67.5
  Top 0.406: U1.24 33.37,45.84 C2.1 | C1.1 36.37,36.72 U1.34 36.4,37.05 36.4,38.4 36.8,38.8 43.6,38.8 44.23,39.43 44.35,39.43 | U1.14 42.8,48.2 v42.8,46.4 | U1.2 44.36,39.44 | 44.36,39.44 44.2,39.6 v44.2,40.4 43.2,41.4 43.2,42 44.6,43.4 45.95,43.4 U1.7 48.2,43.43 C51.1 | 44.35,39.43 U1.44 45.42,37.03 C4.1 45.84,36.6 48.4,36.6 49.6,35.4 49.6,34.2 55,28.8 | 44.35,39.43 44.36,39.44 | R7.2 R6.2 51.18,23.22 51.6,22.8 54,22.8 54.4,23.2 54.4,28.2 55,28.8 | R24.2 39.1,23.98 R12.2 42.2,23.95 42.2,23 42.4,22.8 47.6,22.8 | U$2.P10 26.45,26.65 27.16,27.36 C31.2 27.59,29.16 29.24,29.16 29.8,28.6 29.8,27.85 R31.1 | R31.1 30.15,27.5 | 25.29,5.26 C50.2 24.75,4.75 U2.5 | U$6.P$1 34.26,10.52 | 23.37,2.99 R2.1 | 27.6,67.5 27.6,69 | 27.6,69 27.6,69.42 26.73,70.28 C13.2 25.41,72.8 25.2,72.8 | 27.6,69 27.8,68.8 29.6,68.8 30.45,67.95 R32.1 30.85,67.2 30.85,65.15 30.56,64.86 R13.1 30.76,64.6 32.2,64.6 32.8,64 32.8,57.8 32.4,57.4 28.25,57.4 28.05,57.6 28.05,50.95 C40.2 26.54,48.27 26.8,48 | 24.8,72.8 28.99,72.8 JP1.4 | R1.2 54.17,9.4 | 38.05,10.16 R5.2 | 55,28.8 58.13,28.8 F1.P$2 | 29.25,46.75 R30.1 28.6,47.4 28.6,47.8 28.4,48 26.8,48 | 26.8,48 26.5,47.7 26.35,47.7 26.35,46 26,45.65 U$3.P10 | 31.6,23.2 31.6,24.86 R8.1 31.74,25.91 R31.1
  Top 0.61: 23.37,2.99 25.25,2.99 C49.2 | v3.8,73.4 4.6,74.2 8.6,74.2 10,72.8 24.8,72.8 25.2,72.8 | 27.8,18 28.4,17.4 31.8,17.4 32.6,18.2 | 32.6,18.2 32.6,19.6 32.6,20.8 31.6,21.8 31.6,23.2 | 34.69,12.7 32.6,14.79 32.6,18.2 | R7.2 48.14,23.34 47.6,22.8 45.4,20.6 45.4,14.4 45,14 43,14 42.4,14.6 42.4,15.4 | 54.17,9.4 41,9.4 40.24,10.16 38.05,10.16 | R26.2 38.8,15.13
  Top 0.813: U$6.P$1 35.94,12.27 38.05,10.16
  Top 1: R25.2 R26.2 | 34.26,10.52 30.51,10.52 | 38.8,15.13 38.8,13.8 37.27,12.27 35.94,12.27
  Top 1.016: C49.2 25.29,5.26 | 30.51,10.52 C50.2 | v2.8,3.8 v3.8,2.8 v4.8,1.8 5.2,1.4 25,1.4 25.2,1.6 25.2,3
  Bottom 0.305: v30.8,36 v30.8,33.4 | v42.8,46.4 41.73,45.33 C3.1
  Bottom 0.406: v42.8,46.4 42.77,46.37 | v44.2,40.4 42.74,40.4 C5.1
  Bottom 0.61: 2.8,67.8 2.8,72.4 v3.8,73.4
  Bottom 1: v2.8,3.8 2.8,67.8
  Bottom 1.016: 5.2,1.4 v4.8,1.8 v3.8,2.8 v2.8,3.8
XTAL1
  Top 0.406: Q2.1 41.53,53.79 C8.1 41.19,53.09 40.35,52.25 40.35,48.26 U1.17
XTAL2
  Top 0.406: Q2.2 49.52,56.74 C9.1 | C9.1 46.24,53.24 | U1.16 41.2,48.31 41.2,50.35 41.95,50.35 43.25,51.65 45.65,51.65 46,52 46,53.22 C9.1
~RESET  (via drill 0.6)
  Top 0.305: U1.13 43.56,49.36 v44,49.8
  Top 0.406: 47.47,5.01 SW8.B 48.36,5.56 50.4,7.6 54.16,7.6 C30.1 54.31,7.84 R1.1 55.6,9.97 55.6,26.8 v55.4,27
  Bottom 0.305: v44,49.8 45.4,49.8 46.4,48.8
  Bottom 0.406: 46.4,48.8 46.4,38 55.4,29 v55.4,27